# Altium schematic sheet ST_SYS_Board_Config.schdoc
size 420 x 297 mm; EDA_Number: ARTIQ; Author: G.Kasprowicz; CompanyName: WUT ISE; DrawnBy: G.Kasprowicz; Organization: WUT ISE; DocumentNumber: 12; SheetNumber: 12; ModifiedBy: -; CheckedDate: -; Title2: Configuration; Designer: G.Kasprowicz; ModifiedDate: -; ProjectName: Sensor Box
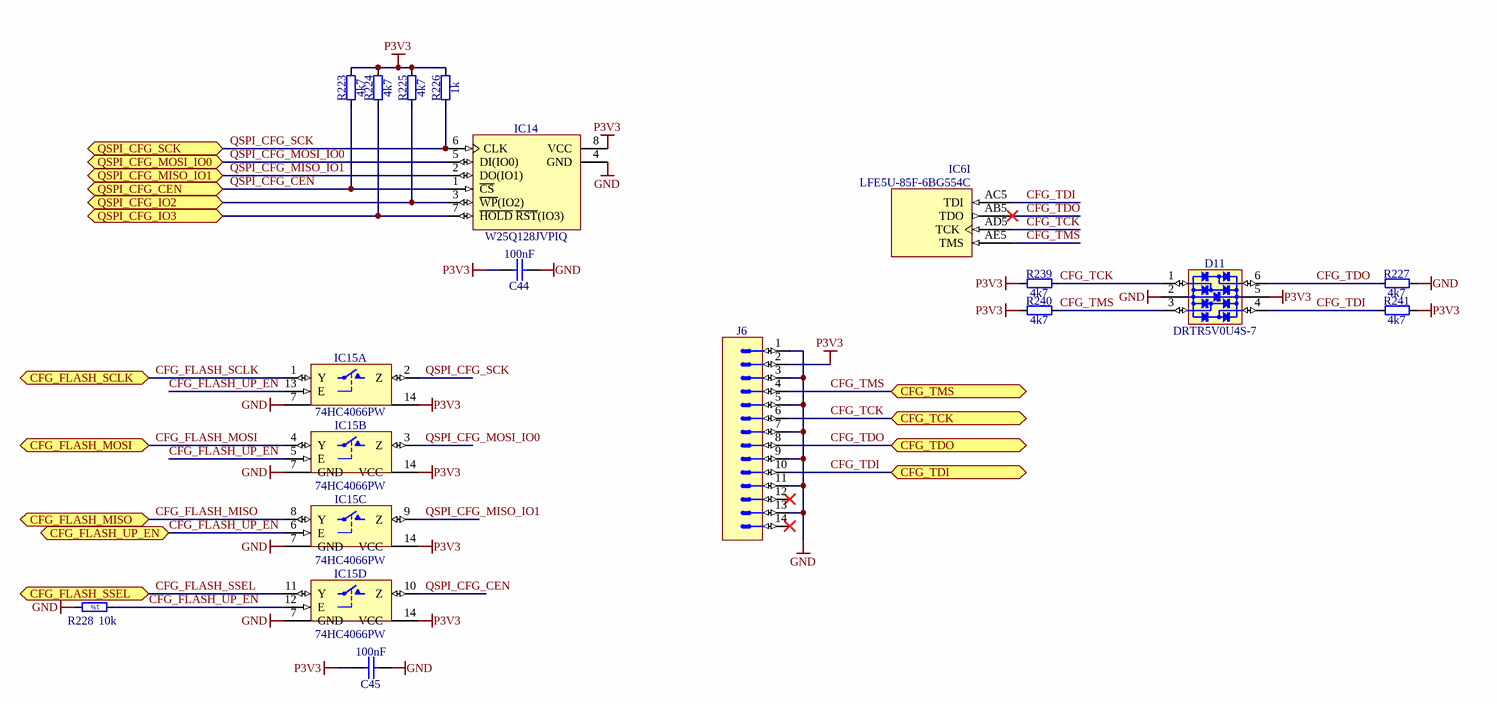
[diagram p0: ST_SYS_Board_Config.schdoc]

## Parts
C44  100nF  [CAPC1005X55N]
C45  100nF  [CAPC1005X55N]
D11  DRTR5V0U4S-7  [SOT65P210X110-6N]
IC6  LFE5U-85F-6BG554C  [BGA554C80P26X26_2300X2300X176]  (part I of 15)
IC14  W25Q128JVPIQ  [SON127P600X500X80-9N-R345X435]
IC15  74HC4066PW  [SOP65P640X110-14N]  (parts A,B,C,D of 4)
J6  Milli-Grid™  [MOLEX_87832-1420]  (value not drawn)
R223  4k7  [RESC1005X40N]
R224  4k7  [RESC1005X40N]
R225  4k7  [RESC1005X40N]
R226  1k  [RESC1005X40N]
R227  4k7  [RESC1005X40N]
R228  10k  [RESC1005X40N]
R239  4k7  [RESC1005X40N]
R240  4k7  [RESC1005X40N]
R241  4k7  [RESC1005X40N]

## Ports
CFG_FLASH_MISO (bidir), CFG_FLASH_MOSI (bidir), CFG_FLASH_SCLK (bidir), CFG_FLASH_SSEL (bidir), CFG_FLASH_UP_EN (bidir), CFG_TCK (bidir), CFG_TDI (bidir), CFG_TDO (bidir), CFG_TMS (bidir), QSPI_CFG_CEN (bidir), QSPI_CFG_IO2 (bidir), QSPI_CFG_IO3 (bidir), QSPI_CFG_MISO_IO1 (bidir), QSPI_CFG_MOSI_IO0 (bidir), QSPI_CFG_SCK (bidir)

## Nets
GND: C44.1 C45.1 D11.2(GND) IC14.4(GND) IC15.7(GND) J6.1 J6.3 J6.5 J6.7 J6.9 J6.11 J6.13 R227.2 R228.2
P3V3: C44.2 C45.2 D11.5(VBUS) IC14.8(VCC) IC15.14(VCC) J6.2 R223.2 R224.2 R225.2 R226.2 R239.1 R240.1 R241.2
CFG_FLASH_MISO: IC15.8(Y) ; port CFG_FLASH_MISO
CFG_FLASH_MOSI: IC15.4(Y) ; port CFG_FLASH_MOSI
CFG_FLASH_SCLK: IC15.1(Y) ; port CFG_FLASH_SCLK
CFG_FLASH_SSEL: IC15.11(Y) ; port CFG_FLASH_SSEL
CFG_FLASH_UP_EN: IC15.5(E) IC15.6(E) IC15.12(E) IC15.13(E) R228.1 ; port CFG_FLASH_UP_EN
CFG_TCK: D11.1(I/O1) IC6.AD5(TCK) J6.6 R239.2 ; port CFG_TCK
CFG_TDI: D11.4(I/O3) IC6.AC5(TDI) J6.10 R241.1 ; port CFG_TDI
CFG_TDO: D11.6(I/O4) IC6.AB5(TDO) J6.8 R227.1 ; port CFG_TDO
CFG_TMS: D11.3(I/O2) IC6.AE5(TMS) J6.4 R240.2 ; port CFG_TMS
QSPI_CFG_CEN: IC14.1(~{CS}) IC15.10(Z) R223.1 ; port QSPI_CFG_CEN
QSPI_CFG_IO2: IC14.3(~{WP}(IO2)) R225.1 ; port QSPI_CFG_IO2
QSPI_CFG_IO3: IC14.7(~{HOLD}_~{RST}(IO3)) R224.1 ; port QSPI_CFG_IO3
QSPI_CFG_MISO_IO1: IC14.2(DO(IO1)) IC15.9(Z) ; port QSPI_CFG_MISO_IO1
QSPI_CFG_MOSI_IO0: IC14.5(DI(IO0)) IC15.3(Z) ; port QSPI_CFG_MOSI_IO0
QSPI_CFG_SCK: IC14.6(CLK) IC15.2(Z) R226.1 ; port QSPI_CFG_SCK

Not connected (* = marked no-connect by the designer): J6 12* 14*

## Notes on the sheet
- Project/Equipment
- Document
- Designer
- Drawn by
- Check.by
- Copyright WUT =Copy(CurrentDate,7,4)
  This document describes Open Hardware and is licensed under the CERN-OHL-W v2
  You may redistribute and modify this documentation and make products using it under the terms of the CERN-OHL-W v2 (https:/cern.ch/cern-ohl). This documentation is distributed WITHOUT ANY EXPRESS OR IMPLIED WARRANTY, INCLUDING OF MERCHANTABILITY, SATISFACTORY QUALITY AND FITNESS FOR A PARTICULAR PURPOSE. Please see the CERN-OHL-W v2 for applicable conditions.
  Source location: =SourceLocation
  As per CERN-OHL-W v2 section 4, should You produce hardware based on these sources, You must maintain the Source Location visible on the silkscreen or top copper for a =Title1 PCB or other product you make using this documentation.
- Contact:
- File
- Last Mod.
- Print Date
- Sheet
- Size
- A3
- of
- Rev
- (in symbol R0402_10K_1%_0.0625W_100PPM) 1%

## Library data of the parts
C44 C45 = CC0402_100NF_16V_10%_X5R: Non-polarised capacitor; Part Description: SMD Multilayer Chip Ceramic Capacitor; Manufacturer: GENERIC; Manufacturer1 Part Number: GRM155R61C104KA88D; Voltage: 16V; TC: X5R; Tolerance: ±10%; Part Number: CC0402_100NF_16V_10%_X5R; Component Kind: Standard; Component Type: Standard; Pin Count: 2; Value: 100nF; Status: None; Manufacturer Part Number: CC0402_100NF_16V_10%_X5R; Case: 0402; Mounted: Yes; Socket: No; SMD: Yes; Sense: No; Manufacturer1 Example: MURATA; Manufacturer1 ComponentHeight: 0.55mm; HelpURL: \\cern.ch\dfs\Applications\Altium\Datasheets\CC0402_X5R_MURATA_GRM.pdf; Author: CERN DEM JLC; CreateDate: 10.12.2013; LatestRevisionDate: 10.12.2013
D11 = D_TVS_DRTR5V0U4S-7: Integrated Quad Ultra-Low Capacitance ESD Protection; Part Description: Integrated Quad Ultra-Low Capacitance ESD (±8kV) Protection; Manufacturer: DIODES; PressFit: No; Bonding: No; Status Comment: Active; Part Number: DRTR5V0U4S-7; Component Kind: Standard; Component Type: Standard; Device: DRTR5V0U4S-7; PackageDescription: SOT363, SC70-6, 0.65mm Pitch; 6 Pin, 1.25mm W X 2.00mm L X 1.10mm H body, IPC Medium Density; Status: Active; Manufacturer Part Number: DRTR5V0U4S-7; Pin Count: 6; Case: SOT363; Mounted: Yes; Socket: No; SMD: Yes; Sense: No; ComponentHeight: 1.1mm; HelpURL: \\cern.ch\dfs\Applications\Altium\Datasheets\PRTR5V0U4Y.pdf; Author: GK; CreateDate: 24.01.2017; LatestRevisionDate: 14.09.2020
IC6 = LFE5U-85F-6BG554C: Part Description: FPGA LatticeECP5 Family 84000 Cells 40nm Technology 1.1V 554-Pin CABGA Tray; Manufacturer: LATTICE SEMICONDUCTOR; PressFit: No; Bonding: No; Part Number: LFE5U-85F-6BG554C; Component Kind: Standard; Component Type: Standard; Device: LFE5U-85F-6BG554C; PackageDescription: BGA, 0.80mm Pitch, Square; 554Pin, 26 Columns X 26 Rows, 23mm X 23mm X 1.76mm H; Manufacturer Part Number: LFE5U-85F-6BG554C; Pin Count: 554; Case: BGA554; Mounted: Yes; Socket: No; SMD: Yes; Sense: No; ComponentHeight: 1.76mm; HelpURL: \\cern.ch\dfs\Applications\Altium\Datasheets\LFE5U-85F-6BG554C.pdf; ComponentLink1URL: \\cern.ch\dfs\Applications\Altium\Datasheets\LATTICE_Package.pdf; ComponentLink1Description: Package Drawing; ComponentLink2URL: \\cern.ch\dfs\Applications\Altium\Datasheets\LFE5U-85F-6BG554C_Pinout.pdf; ComponentLink2Description: Pinout; Author: CERN DEM HF; CreateDate: 18.02.2022; LatestRevisionDate: 18.02.2022
IC14 = W25Q128JVPIQ: 128M-bit Serial Flash Memory with uniform 4KB sectors and Dual/Quad SPI and QPI; Manufacturer: WINBOND; PressFit: No; Bonding: No; Part Number: W25Q128JVPIQ; Component Kind: Standard; Component Type: Standard; Device: W25Q128JVPIQ; PackageDescription: SON, 1.27mm Pitch; 8 Pin, 6.00mm W X 5.00mm L X 0.8mm H body (w/Thermal Tab 3.45mm x 4.35mm); Part Description: 128M-bit Serial Flash Memory with uniform 4KB sectors and Dual/Quad SPI and QPI; Manufacturer Part Number: W25Q128JVPIQ; Pin Count: 9; Case: SON8; Mounted: Yes; Socket: No; SMD: Yes; Sense: No; ComponentHeight: 0.8mm; HelpURL: \\cern.ch\dfs\Applications\Altium\Datasheets\W25Q128JVPIQ.pdf; Author: CERN DEM BC; CreateDate: 24.01.2019; LatestRevisionDate: 24.01.2019
IC15 = 74HC4066PW: Part Description: Quad Single-Pole Single-Throw Analog Switch; Manufacturer: NXP SEMICONDUCTORS; PressFit: No; Bonding: No; Table: Standard Logic; Part Number: 74HC4066PW; Component Kind: Standard; Component Type: Standard; Device: 74HC4066PW; PackageDescription: SOP, 14-Leads, Body 4.4x5mm (max), Pitch 0.65mm, IPC Medium Density; Manufacturer Part Number: 74HC4066PW; Pin Count: 14; Case: TSSOP14; Mounted: Yes; Socket: No; SMD: Yes; ComponentHeight: 1.1mm; Author: CERN DEM JLC; HelpURL: \\cern.ch\dfs\Applications\Altium\Datasheets\74HC4066PW.pdf; CreateDate: 2014-11-19; LatestRevisionDate: 2014-11-19
J6 = MOLEX_87832-1420: Connector 14 Male; Part Description: 2.00mm (.079") Pitch Milli-Grid™ Header, Surface Mount, Vertical, Shrouded, 14 Circuits,with Locking Windows and Centre Polarization Slot, PCB Locator; Manufacturer: MOLEX; PressFit: No; Part Number: MOLEX_87832-1420; Component Kind: Standard; Component Type: Standard; Pin Count: 14; Family: Milli-Grid™; Mounted: Yes; Socket: No; SMD: Yes; Sense: No; Status: None; Manufacturer Part Number: 87832-1420; ComponentHeight: 7.6mm; HelpURL: \\cern.ch\dfs\Applications\Altium\Datasheets\MOLEX_87832-1420.pdf; Author: CERN DEM JLC; CreateDate: 09.09.2008; LatestRevisionDate: 09.09.2008
R223-R225 R227 R239-R241 = R0402_4k7_1%_0.0625W_100PPM: Resistor - 1%; Part Description: General Purpose Thick Film Chip Resistor; Manufacturer: GENERIC; Manufacturer1 Part Number: 232270674702L; TC: ±100ppm/°C; PressFit: No; Part Number: R0402_4K7_1%_0.0625W_100PPM; Component Kind: Standard; Component Type: Standard; Pin Count: 2; Value: 4k7; Status: Not Recommended; Power: 0.0625W; Tolerance: ±1%; Manufacturer Part Number: R0402_4K7_1%_0.0625W_100PPM; Case: 0402; Mounted: Yes; Sense: No; Socket: No; SMD: Yes; Manufacturer1 Example: YAGEO PHYCOMP; Manufacturer1 ComponentHeight: 0.4mm; HelpURL: \\cern.ch\dfs\Applications\Altium\Datasheets\R0402_Phycomp_RC0402.pdf; Author: CERN DEM JLC; CreateDate: 03.12.2007; LatestRevisionDate: 17.10.2012
R226 = R0402_1k_1%_0.0625W_100PPM: Resistor - 1%; Part Description: General Purpose Thick Film Chip Resistor; Manufacturer: GENERIC; Manufacturer1 Part Number: 232270671002L; TC: ±100ppm/°C; PressFit: No; Part Number: R0402_1K_1%_0.0625W_100PPM; Component Kind: Standard; Component Type: Standard; Pin Count: 2; Value: 1k; Status: Not Recommended; Power: 0.0625W; Tolerance: ±1%; Manufacturer Part Number: R0402_1K_1%_0.0625W_100PPM; Case: 0402; Mounted: Yes; Sense: No; Socket: No; SMD: Yes; Manufacturer1 Example: YAGEO PHYCOMP; Manufacturer1 ComponentHeight: 0.4mm; HelpURL: \\cern.ch\dfs\Applications\Altium\Datasheets\R0402_Phycomp_RC0402.pdf; Author: CERN DEM JLC; CreateDate: 03.12.2007; LatestRevisionDate: 17.10.2012
R228 = R0402_10K_1%_0.0625W_100PPM: Resistor - 1%; Part Description: General Purpose Thick Film Chip Resistor; Manufacturer: GENERIC; Manufacturer1 Part Number: 232270671003L; TC: ±100ppm/°C; Table: Resistors SMD; Part Number: R0402_10K_1%_0.0625W_100PPM; Component Kind: Standard; Component Type: Standard; Pin Count: 2; Value: 10k; Status: Not recommended; Power: 0.0625W; Tolerance: ±1%; Manufacturer Part Number: R0402_10K_1%_0.0625W_100PPM; Case: 0402; Mounted: Yes; Socket: No; SMD: Yes; Manufacturer1 Example: YAGEO PHYCOMP; Manufacturer1 ComponentHeight: 0.4mm; HelpURL: \\cern.ch\dfs\Applications\Altium\Datasheets\R0402_Phycomp_RC0402.pdf; Author: CERN DEM JLC; CreateDate: 2007-12-03; LatestRevisionDate: 2012-10-17